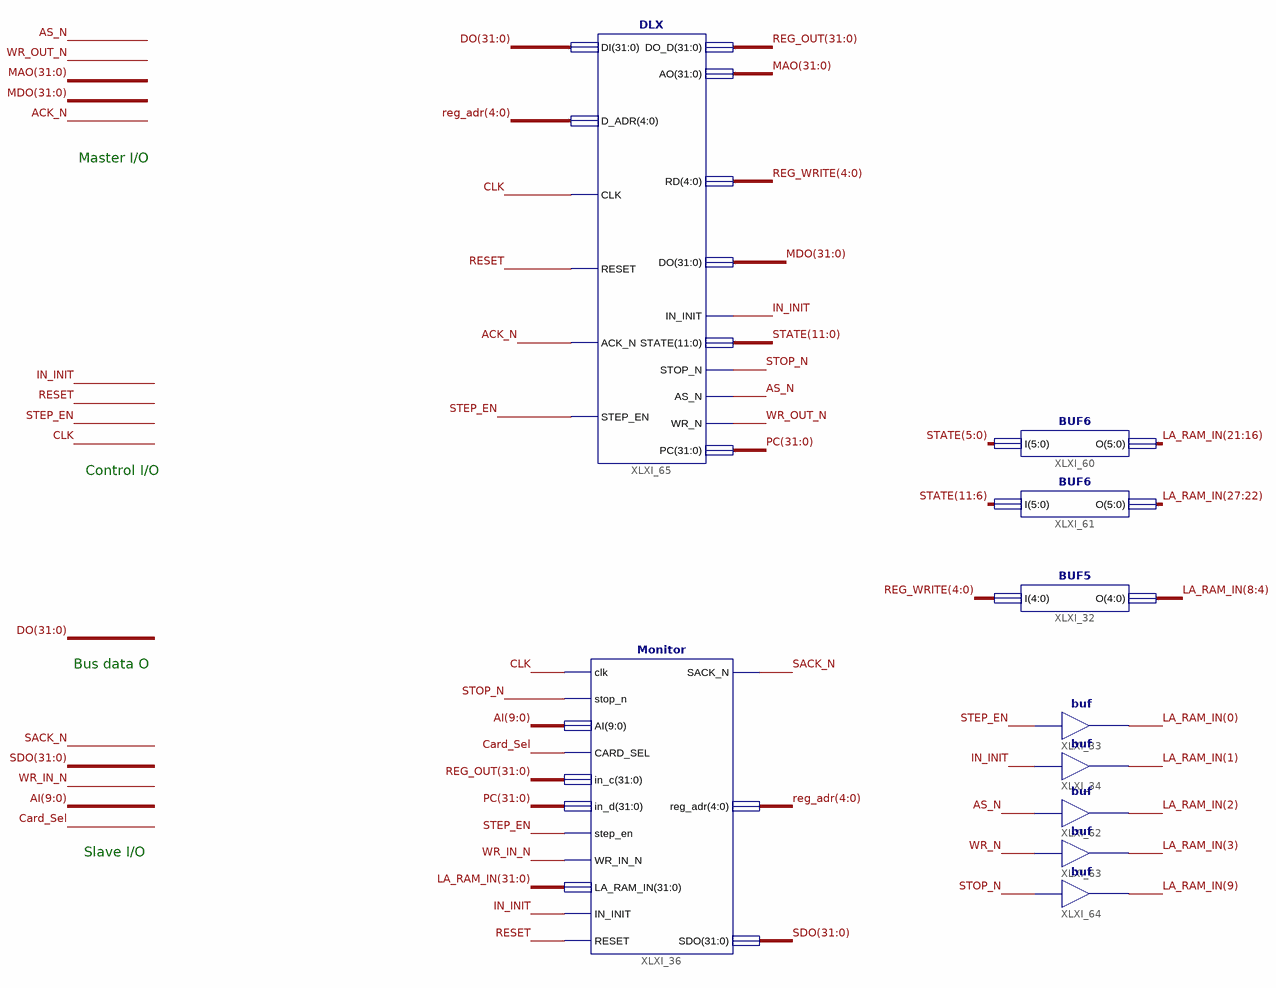
[diagram p0: schematic sheet 1]
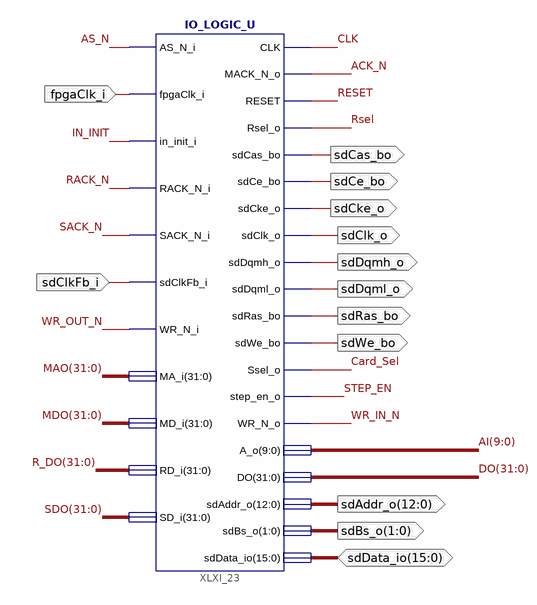
[diagram p1: schematic sheet 2]
// Xilinx ISE schematic Top_Level.sch (spartan6) as structural Verilog: 11 symbols, 13 ports
module Top_Level (
  input  fpgaClk_i,
  input  sdClkFb_i,
  inout  [15:0] sdData_io,
  output sdClk_o,
  output [1:0] sdBs_o,
  output sdDqml_o,
  output sdDqmh_o,
  output sdWe_bo,
  output sdCas_bo,
  output sdRas_bo,
  output sdCe_bo,
  output sdCke_o,
  output [12:0] sdAddr_o
);

  wire ACK_N, AS_N, Card_Sel, CLK, IN_INIT, RACK_N, RESET, Rsel, SACK_N, STEP_EN, STOP_N, WR_IN_N, WR_N,
       WR_OUT_N;
  wire [4:0] reg_adr, REG_WRITE;
  wire [9:0] AI;
  wire [11:0] STATE;
  wire [31:0] DO, LA_RAM_IN, MAO, MDO, PC, R_DO, REG_OUT, SDO;

  IO_LOGIC_U XLXI_23 (
    .AS_N_i(AS_N), .fpgaClk_i(fpgaClk_i), .in_init_i(IN_INIT), .RACK_N_i(RACK_N), .SACK_N_i(SACK_N),
    .sdClkFb_i(sdClkFb_i), .WR_N_i(WR_OUT_N), .MA_i(MAO), .MD_i(MDO), .RD_i(R_DO), .SD_i(SDO), .CLK(CLK),
    .MACK_N_o(ACK_N), .RESET(RESET), .Rsel_o(Rsel), .sdCas_bo(sdCas_bo), .sdCe_bo(sdCe_bo),
    .sdCke_o(sdCke_o), .sdClk_o(sdClk_o), .sdDqmh_o(sdDqmh_o), .sdDqml_o(sdDqml_o), .sdRas_bo(sdRas_bo),
    .sdWe_bo(sdWe_bo), .Ssel_o(Card_Sel), .step_en_o(STEP_EN), .WR_N_o(WR_IN_N), .A_o(AI), .DO(DO),
    .sdAddr_o(sdAddr_o), .sdBs_o(sdBs_o), .sdData_io(sdData_io));
  BUF5 XLXI_32 (.I(REG_WRITE), .O(LA_RAM_IN[8:4]));
  Monitor XLXI_36 (
    .clk(CLK), .stop_n(STOP_N), .AI(AI), .CARD_SEL(Card_Sel), .in_c(REG_OUT), .in_d(PC), .step_en(STEP_EN),
    .WR_IN_N(WR_IN_N), .LA_RAM_IN(LA_RAM_IN), .IN_INIT(IN_INIT), .RESET(RESET), .SACK_N(SACK_N),
    .reg_adr(reg_adr), .SDO(SDO));
  buf XLXI_33 (LA_RAM_IN[0], STEP_EN);
  buf XLXI_34 (LA_RAM_IN[1], IN_INIT);
  BUF6 XLXI_60 (.I(STATE[5:0]), .O(LA_RAM_IN[21:16]));
  BUF6 XLXI_61 (.I(STATE[11:6]), .O(LA_RAM_IN[27:22]));
  buf XLXI_62 (LA_RAM_IN[2], AS_N);
  buf XLXI_63 (LA_RAM_IN[3], WR_N);
  buf XLXI_64 (LA_RAM_IN[9], STOP_N);
  DLX XLXI_65 (
    .DI(DO), .D_ADR(reg_adr), .CLK(CLK), .RESET(RESET), .ACK_N(ACK_N), .STEP_EN(STEP_EN), .DO_D(REG_OUT),
    .AO(MAO), .RD(REG_WRITE), .DO(MDO), .IN_INIT(IN_INIT), .STATE(STATE), .STOP_N(STOP_N), .AS_N(AS_N),
    .WR_N(WR_OUT_N), .PC(PC));

  // Notes on the sheet:
  //   Master I/O
  //   Control I/O
  //   Bus data O
  //   Slave I/O
endmodule
